# Altium project STLINK.PrjPCB
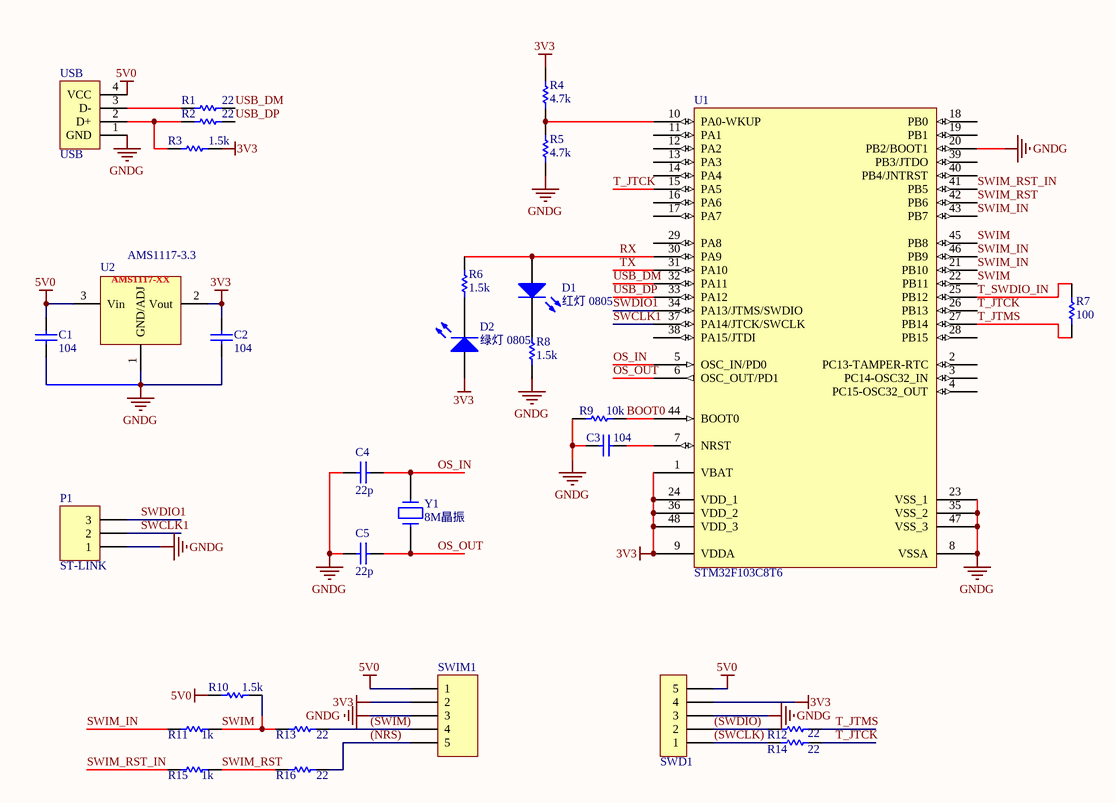
[diagram p0: STLINK.SchDoc]
1 sheet, 30 parts. Net scope: global (net labels, ports and power ports of the same name join across sheets).
Board file: STLINK.PcbDoc

## Sheet STLINK.SchDoc
size A4

### Parts
C1  104  [C0805_L]
C2  104  [C0805_L]
C3  104  [C0805_L]
C4  value 22p  [C0805_L]  (hidden comment: 22pf)
C5  value 22p  [C0805_L]  (hidden comment: 22pf)
D1  红灯 0805  [LC-0805_LED_S1]
D2  绿灯 0805  [LC-0805_LED_S1]
P1  ST-LINK  [HDR1X3]
R1  value 22  [0805_L]  (hidden comment: 22R)
R2  value 22  [0805_L]  (hidden comment: 22R)
R3  1.5k  [0805_L]
R4  4.7k  [0805_L]
R5  4.7k  [0805_L]
R6  1.5k  [0805_L]
R7  value 100  [0805_L]  (hidden comment: 100R)
R8  1.5k  [0805_L]
R9  10k  [0805_L]
R10  1.5k  [0805_L]
R11  1k  [0805_L]
R12  value 22  [0805_L]  (hidden comment: 22R)
R13  value 22  [0805_L]  (hidden comment: 22R)
R14  value 22  [0805_L]  (hidden comment: 22R)
R15  1k  [0805_L]
R16  value 22  [0805_L]  (hidden comment: 22R)
SWD1  Head5  [HEADER 5]  (value not drawn)
SWIM1  Header 5  [HEADER 5]  (value not drawn)
U1  STM32F103C8T6  [LQFP48_N]
U2  AMS1117-3.3  [SOT-223]
USB  USB  [USB_A_G]
Y1  8M晶振  [XTAL_2]

### Nets
3V3: C2.2 D2.A R3.2 R4.2 SWD1.4 SWIM1.2 U1.1(VBAT) U1.9(VDDA) U1.24(VDD_1) U1.36(VDD_2) U1.48(VDD_3) U2.2(Vout)
5V0: C1.2 R10.1 SWD1.5 SWIM1.1 U2.3(Vin) USB.4(VCC)
GNDG: C1.1 C2.1 C3.1 C4.1 C5.1 P1.1 R5.1 R8.1 R9.1 SWD1.3 SWIM1.3 U1.8(VSSA) U1.20(PB2/BOOT1) U1.23(VSS_1) U1.35(VSS_2) U1.47(VSS_3) U2.1(GND/ADJ) USB.1(GND)
(NRS): R16.1 SWIM1.5
(SWCLK): R14.1 SWD1.1
(SWDIO): R12.1 SWD1.2
(SWIM): R13.1 SWIM1.4
BOOT0: R9.2 U1.44(BOOT0)
OS_IN: C4.2 U1.5(OSC_IN/PD0) Y1.2
OS_OUT: C5.2 U1.6(OSC_OUT/PD1) Y1.1
RX: D1.A R6.2 U1.30(PA9)
SWCLK1: P1.2 U1.37(PA14/JTCK/SWCLK)
SWDIO1: P1.3 U1.34(PA13/JTMS/SWDIO)
SWIM: R10.2 R11.2 R13.2 U1.22(PB11) U1.45(PB8)
SWIM_IN: R11.1 U1.21(PB10) U1.43(PB7) U1.46(PB9)
SWIM_RST: R15.2 R16.2 U1.42(PB6)
SWIM_RST_IN: R15.1 U1.41(PB5)
T_JTCK: R14.2 U1.15(PA5) U1.26(PB13)
T_JTMS: R7.1 R12.2 U1.27(PB14)
T_SWDIO_IN: R7.2 U1.25(PB12)
TX: U1.31(PA10)
USB_DM: R1.2 U1.32(PA11)
USB_DP: R2.2 U1.33(PA12)
NetC3_2: C3.2 U1.7(NRST)
NetD1_K: D1.K R8.2
NetD2_K: D2.K R6.1
NetR1_1: R1.1 USB.3(D-)
NetR2_1: R2.1 R3.1 USB.2(D+)
NetR4_1: R4.1 R5.2 U1.10(PA0-WKUP)

Not connected (* = marked no-connect by the designer): U1 2(PC13-TAMPER-RTC) 3(PC14-OSC32_IN) 4(PC15-OSC32_OUT) 11(PA1) 12(PA2) 13(PA3) 14(PA4) 16(PA6) 17(PA7) 18(PB0) 19(PB1) 28(PB15) 29(PA8) 38(PA15/JTDI) 39(PB3/JTDO) 40(PB4/JNTRST)

### Library data of the parts
C1-C5 = Cap
  C1-C3: Value: 104
D1 D2 = 0805 蓝灯: 发光二极管; ComponentLink1Description: 供应商链接; ComponentLink1URL: http://www.szlcsc.com/product/details_2666.html; Package: 0805; Supplier: LC; SuppliersPartNumber: C2293
P1 = Header 3: Header, 3-Pin; LatestRevisionDate: 17-Jul-2002; LatestRevisionNote: Re-released for DXP Platform.; Publisher: Altium Limited
R1-R16 = RES
  R3 R6 R8 R10: Value: 1.5k
  R4 R5: Value: 4.7k
  R9: Value: 10k
  R11 R15: Value: 1k
SWD1 = HEAD 5
SWIM1 = Header 5: Header, 5-Pin; LatestRevisionDate: 17-Jul-2002; LatestRevisionNote: Re-released for DXP Platform.; Publisher: Altium Limited
U1 = STM32F103C8T6: STM32 ARM-based 32-bit MCU with 64 Kbytes Flash, 48-pin LQFP, Industrial Temperature; Published: 30-May-2008; DatasheetVersion: rev6, Mar-2008; PackageVersion: Mar-2008; PackageReference: LQFP48; Publisher: Altium Limited; PackageDescription: 48-Pin Low-Profile Quad Flat Pack, 7 x 7 mm Body, 0.5 mm Pitch (LQFP48); ComponentLink1Description: Manufacturer Link; ComponentLink1URL: www.st.com/stm32; ComponentLink2Description: Datasheet; ComponentLink2URL: http://www.st.com/stonline/products/literature/ds/13587.pdf
U2 = AMS1117-XX: AMS   800mA LOW DROPOUT VOLTAGE REGULATOR
USB = USB_G
Y1 = XTAL